# EAGLE design metronome_v1 (EAGLE 6.1)
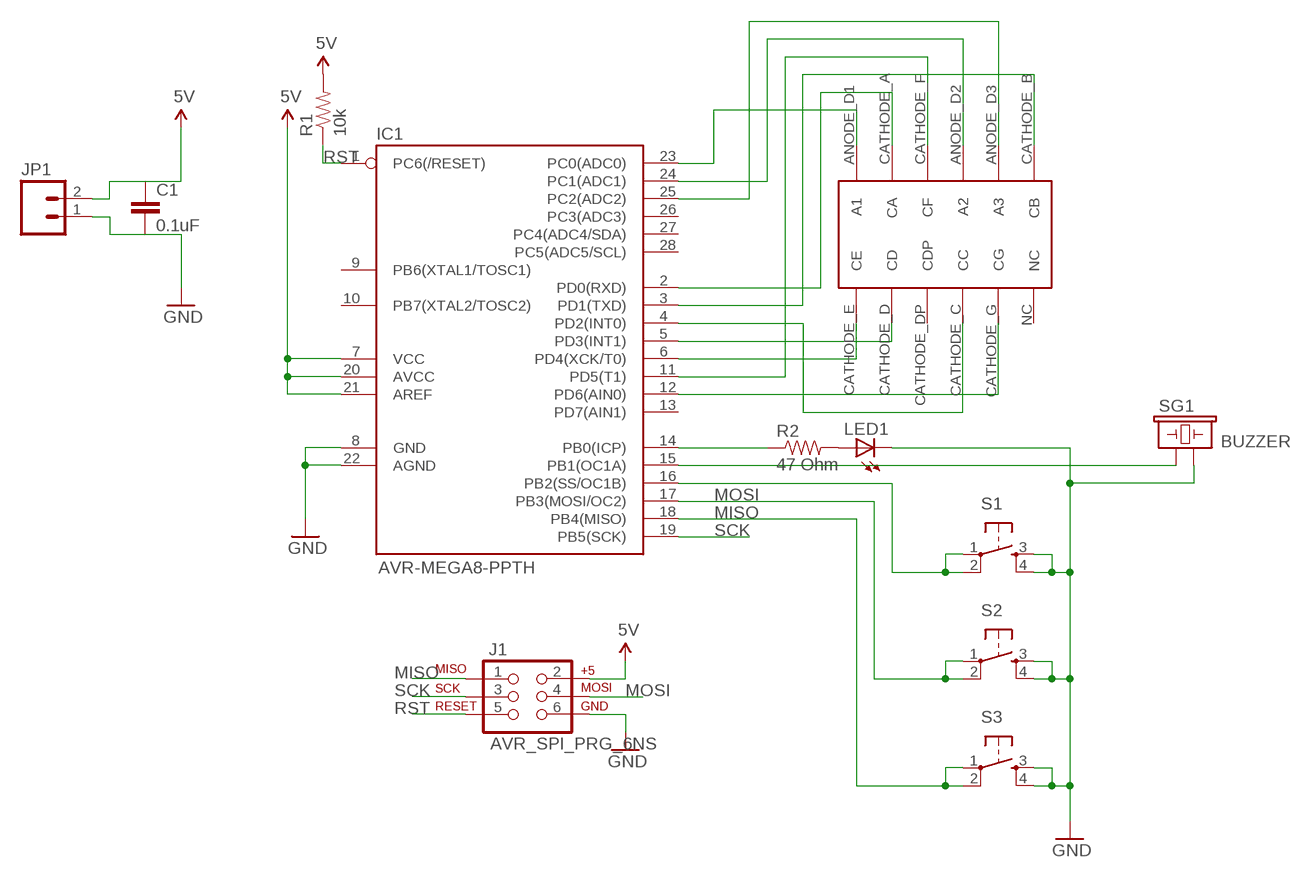
[diagram p0: schematic, sheet 1]

## Parts
C1  0.1uF  CAPPTH  [CAP-PTH-SMALL]
IC1  AVR-MEGA8-PPTH  [DIL28-3]
J1  AVR_SPI_PRG_6NS  [2X3-NS]
JP1  M02PTH3  [1X02_LONGPADS]
LED1  LED5MM  [LED5MM]
R1  10k  RESISTORAXIAL-0.3  [AXIAL-0.3]
R2  47 Ohm  RESISTORAXIAL-0.3  [AXIAL-0.3]
S1  TAC_SWITCHPTH  [TACTILE-PTH]
S2  TAC_SWITCHPTH  [TACTILE-PTH]
S3  TAC_SWITCHPTH  [TACTILE-PTH]
SG1  BUZZER  [BUZZER-762MM]
U$1  7-SEGMENT-3DIGIT-LTC516R  [7-SEGMENT-3DIGIT-LTC561R]

## Nets
5V: C1.1 IC1.7(VCC) IC1.20(AVCC) IC1.21(AREF) J1.2 JP1.2 R1.P$2
GND: C1.2 IC1.8(GND) IC1.22(AGND) J1.6 JP1.1 LED1.K(C) S1.3 S1.4 S2.3 S2.4 S3.3 S3.4 SG1.P$2
MISO: IC1.18(PB4(MISO)) J1.1 S3.1 S3.2
MOSI: IC1.17(PB3(MOSI/OC2)) J1.4 S2.1 S2.2
N$1: LED1.A R2.P$2
N$2: IC1.14(PB0(ICP)) R2.P$1
N$3: IC1.2(PD0(RXD)) U$1.CATHODE_A(CA)
N$4: IC1.3(PD1(TXD)) U$1.CATHODE_B(CB)
N$5: IC1.15(PB1(OC1A)) SG1.P$1
N$6: IC1.16(PB2(SS/OC1B)) S1.1 S1.2
N$9: IC1.4(PD2(INT0)) U$1.CATHODE_C(CC)
N$10: IC1.5(PD3(INT1)) U$1.CATHODE_D(CD)
N$11: IC1.6(PD4(XCK/T0)) U$1.CATHODE_E(CE)
N$12: IC1.11(PD5(T1)) U$1.CATHODE_F(CF)
N$13: IC1.12(PD6(AIN0)) U$1.CATHODE_G(CG)
N$14: IC1.23(PC0(ADC0)) U$1.ANODE_D1(A1)
N$15: IC1.24(PC1(ADC1)) U$1.ANODE_D2(A2)
N$16: IC1.25(PC2(ADC2)) U$1.ANODE_D3(A3)
RST: IC1.1(PC6(/RESET)) J1.5 R1.P$1
SCK: IC1.19(PB5(SCK)) J1.3
Unconnected: IC1.9(PB6(XTAL1/TOSC1)) IC1.10(PB7(XTAL2/TOSC2)) IC1.13(PD7(AIN1)) IC1.26(PC3(ADC3)) IC1.27(PC4(ADC4/SDA)) IC1.28(PC5(ADC5/SCL)) U$1.CATHODE_DP(CDP) U$1.NC

## Library data of the parts
C1 = SparkFun-Passives:CAP: Capacitor Standard 0603 ceramic capacitor, and 0.1" leaded capacitor.
IC1 = SparkFun-DigitalIC:AVR-MEGA8-P: MICROCONTROLLER 8 Kbytes FLASH 1 kbytes SRAM 512 bytes EEPROM USART 4-channel 10 bit ADC 2-channel 8 bit ADC
J1 = SparkFun-Connectors:AVR_SPI_PRG_6: AVR ISP 6 Pin This is the reduced ISP connector for AVR programming. Common on Arduino. This footprint will take up less PCB space and can be used with a 10-pin to 6-pin adapter such as SKU: BOB-08508
JP1 = SparkFun-Connectors:M02: Header 2 Standard 2-pin 0.1" header. Use with straight break away headers (SKU : PRT-00116), right angle break away headers (PRT-00553), swiss pins (PRT-00743), machine pins (PRT-00117), and female headers (PRT-00115). Molex polarized connector foot print use with SKU : PRT-08233 with associated crimp pins and housings.
LED1 = SparkFun-LED:LED: LEDs Standard schematic elements and footprints for 5mm, 3mm, 1206, and 0603 sized LEDs. 5mm - Spark Fun Electronics SKU : COM-00529 (and others)
R1 R2 = SparkFun-Passives:RESISTOR: Resistor Basic schematic elements and footprints for 0603, 1206, and PTH resistors.
S1-S3 = SparkFun-Electromechanical:TAC_SWITCH: Momentary Switch Button commonly used for reset or general input. Spark Fun Electronics SKU : COM-00097
SG1 = SparkFun-Electromechanical:BUZZER: Buzzer 12mm Spark Fun Electronics SKU : Comp-Buzzer
U$1 = SparkFun-Displays:7-SEGMENT-3DIGIT-LTC516R

## Board
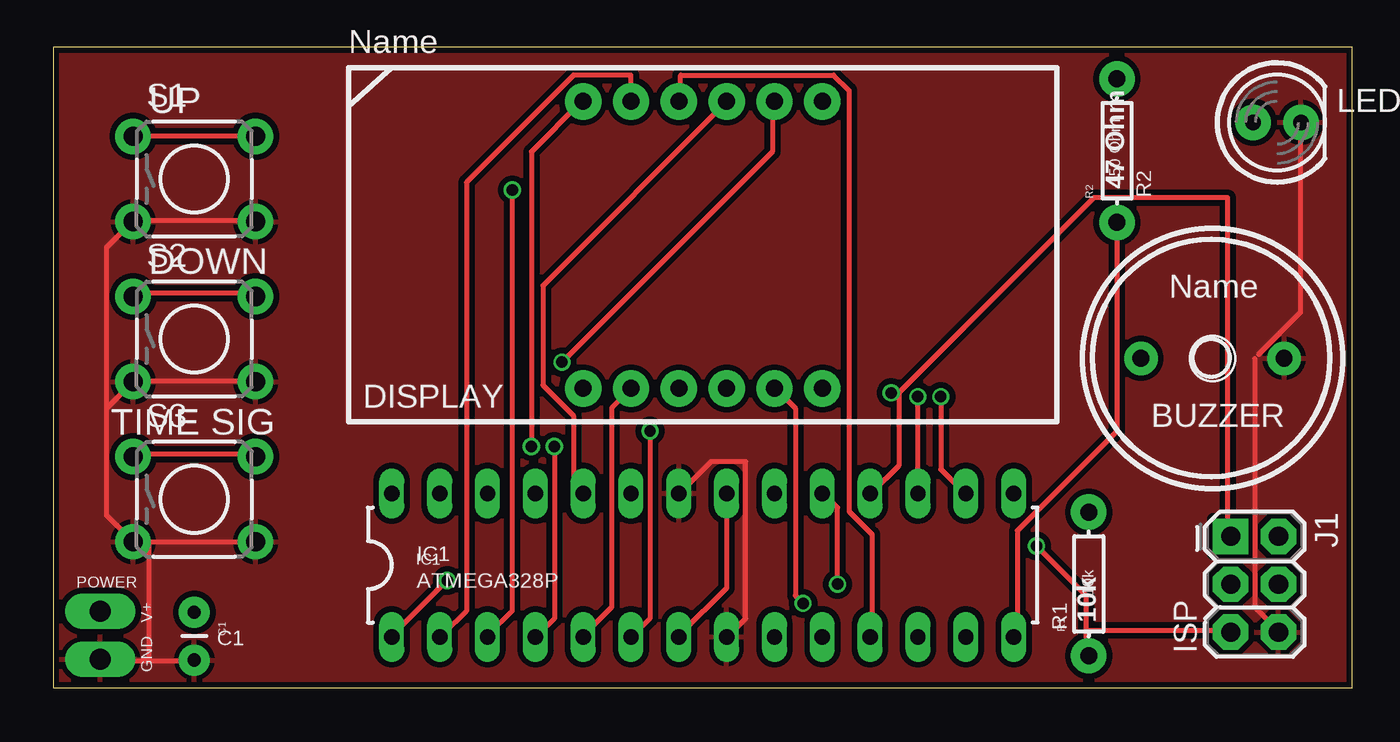
[diagram p1: board, top side]
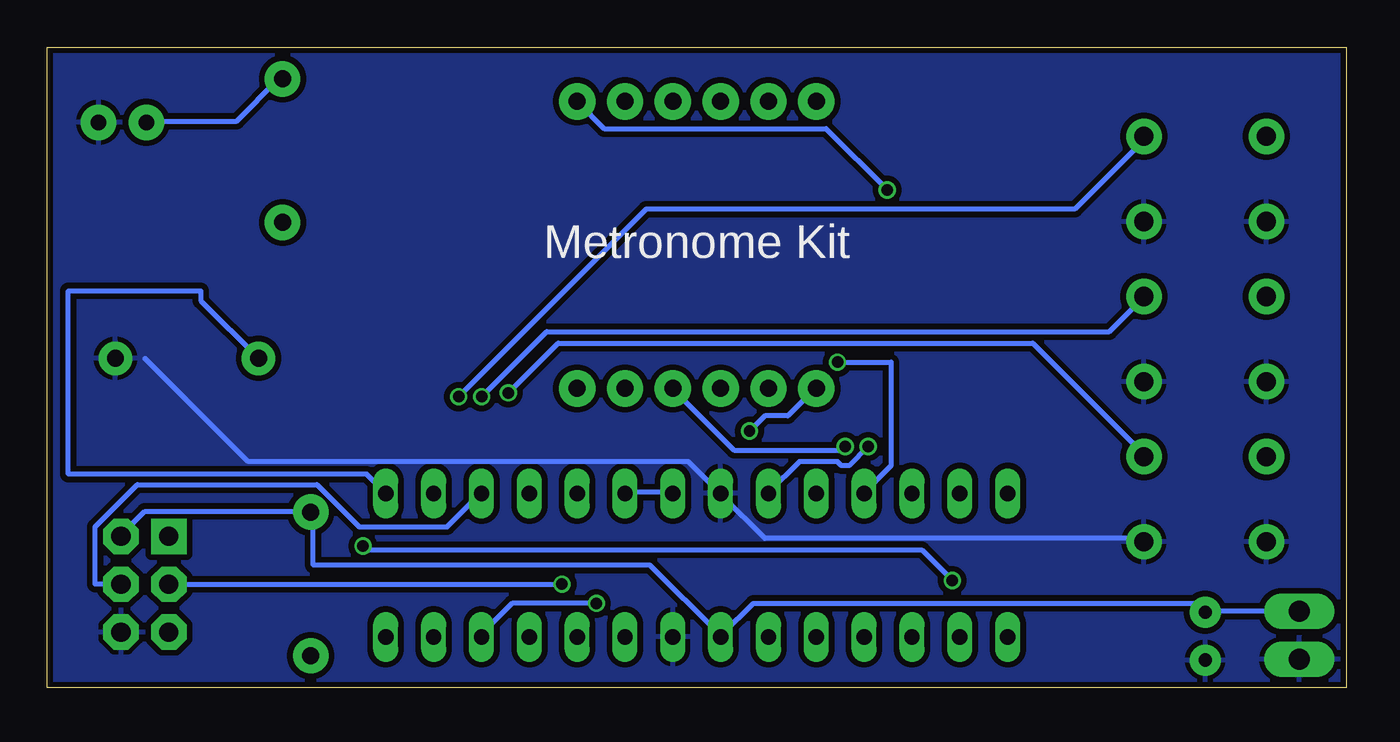
[diagram p2: board, bottom side, seen from below]

Size 69 x 34 mm. Coordinates in mm from the lower left corner, seen from the top.
Outline: 0,0 69,0 69,34 0,34 0,0
Copper layers (1*16): Top 0.035mm / dielectric 1.5mm / Bottom 0.035mm
Design rules: minimum track width 6mil, minimum drill 12mil, track to track 6mil, track to pad 6mil, pad to pad 6mil, via to via 6mil, smd to smd 0mil, copper to edge 10mil, drill to drill 10mil, minimum pad ring 10mil, minimum via ring 6mil, stop-mask expansion 2mil, vias tented up to drill 100mil, thermal gap 10mil

### Footprints (pad centres in the part's own frame; a part is rotated, then mirrored left to right if it is on the bottom)
CAP-PTH-SMALL = drill 0.7 pad 1.651: 1 0,0; 2 2.54,0
DIL28-3 = drill 0.813 long: 1 -16.51,-3.81; 2 -13.97,-3.81; 3 -11.43,-3.81; 4 -8.89,-3.81; 5 -6.35,-3.81; 6 -3.81,-3.81; 7 -1.27,-3.81; 8 1.27,-3.81; 9 3.81,-3.81; 10 6.35,-3.81; 11 8.89,-3.81; 12 11.43,-3.81; 13 13.97,-3.81; 14 16.51,-3.81; 15 16.51,3.81; 16 13.97,3.81; 17 11.43,3.81; 18 8.89,3.81; 19 6.35,3.81; 20 3.81,3.81; 21 1.27,3.81; 22 -1.27,3.81; 23 -3.81,3.81; 24 -6.35,3.81; 25 -8.89,3.81; 26 -11.43,3.81; 27 -13.97,3.81; 28 -16.51,3.81
2X3-NS = drill 1.016 pad 1.88 square: 1 -2.54,-1.27 | drill 1.016 pad 1.88 octagon: 2 -2.54,1.27; 3 0,-1.27; 4 0,1.27; 5 2.54,-1.27; 6 2.54,1.27
1X02_LONGPADS = drill 1.118 pad 1.88 long: 1 0,0; 2 2.54,0
LED5MM = drill 0.813 pad 1.88: A -1.27,0; K 1.27,0
AXIAL-0.3 = drill 0.9 pad 1.88: P$1 -3.81,0; P$2 3.81,0
TACTILE-PTH = drill 1.016 pad 1.88: 1 -3.251,2.261; 2 3.251,2.261; 3 -3.251,-2.261; 4 3.251,-2.261
BUZZER-762MM = drill 0.9 pad 1.778: P$1 -3.8,0; P$2 3.8,0
7-SEGMENT-3DIGIT-LTC561R = drill 0.9 pad 1.93: ANODE_D1 -6.35,7.62; ANODE_D2 1.27,7.62; ANODE_D3 3.81,7.62; CATHODE_A -3.81,7.62; CATHODE_B 6.35,7.62; CATHODE_C 1.27,-7.62; CATHODE_D -3.81,-7.62; CATHODE_DP -1.27,-7.62; CATHODE_E -6.35,-7.62; CATHODE_F -1.27,7.62; CATHODE_G 3.81,-7.62; NC 6.35,-7.62

### Placement (x,y rotation side)
C1  7.5,4 270 top
IC1  34.5,6.5 0 top
J1  63.8,5.49 270 top
JP1  2.5,1.5 90 top
LED1  65,30 0 top
R1  55,5.5 90 top
R2  56.5,28.5 90 top
S1  7.5,27 0 top
S2  7.5,18.5 0 top
S3  7.5,10 0 top
SG1  61.57,17.48 0 top
U$1  34.5,23.5 0 top

### Tracks (layer width: path | path; a pad name or v marks a point on that pad's centre or on a via)
5V
  Top 0.254: IC1.7 33.33,2.85 35.76,5.28 35.76,10.16 IC1.21
  Bottom 0.254: J1.2 65.02,8.13 63.8,9.35 55.07,9.35 R1.P$2 54.86,9.14 54.86,6.5 36.98,6.5 33.33,2.85 IC1.7 33.12,2.85 31.5,4.47 7.92,4.47 7.52,4.06 C1.1 7.32,4.06 2.64,4.06 JP1.2 | IC1.20 38.2,10.36 35.97,10.36 IC1.21
GND
  Top 0.254: 64.01,17.68 66.24,19.91 66.24,29.87 LED1.K | 63.8,17.48 63.8,4.27 65.02,3.05 J1.6 | IC1.22 33.33,10.36 34.95,11.99 36.78,11.99 36.78,3.66 35.97,2.85 IC1.8 | S1.4 10.57,24.79 4.27,24.79 S1.3 4.06,24.59 2.85,23.37 2.85,14.83 | S2.4 10.57,16.26 4.27,16.26 S2.3 4.06,16.05 2.85,14.83 | 5.08,1.42 2.64,1.42 JP1.1 | 5.08,1.42 7.32,1.42 C1.2 | 5.08,7.72 10.57,7.72 S3.4 | 5.08,7.72 4.27,7.72 S3.3 | 5.08,7.72 5.08,1.42 | 5.08,7.72 S3.3 | 2.85,14.83 2.85,9.14 4.06,7.92 S3.3
  Bottom 0.254: S3.4 10.77,7.92 30.89,7.92 33.12,10.16 IC1.22 33.33,10.36 34.95,11.99 58.32,11.99 63.8,17.48
  pour Top (isolate 0.305): 0,34.01 69.01,34.01 69.01,0 0,0
  pour Bottom (isolate 0.305): 0,34.01 69.01,34.01 69.01,0 0,0
MISO  (via drill 0.61)
  Top 0.254: S3.1 4.27,12.39 10.57,12.39 S3.2 | 44.91,15.65 44.91,11.79 43.48,10.36 IC1.18 | 44.91,15.65 55.27,26.01 62.38,26.01 62.38,8.13 J1.1 | 44.91,15.65 v44.5,15.65
  Bottom 0.254: v44.5,15.65 41.86,18.29 16.66,18.29 10.77,12.39 S3.2
MOSI  (via drill 0.61)
  Top 0.254: S2.1 4.27,20.93 10.57,20.93 S2.2 | v45.92,15.44 45.92,10.36 IC1.17
  Bottom 0.254: J1.4 66.45,5.49 66.45,8.53 64.21,10.77 54.66,10.77 52.43,8.53 47.75,8.53 46.13,10.16 IC1.17 | v45.92,15.44 42.47,18.9 12.6,18.9 10.77,20.73 S2.2
N$1
  Bottom 0.254: R2.P$2 56.69,32.31 58.93,30.07 63.6,30.07 LED1.A
N$2
  Top 0.254: IC1.14 51.21,2.85 51.21,8.33 56.49,13.61 56.49,24.59 R2.P$1
N$3
  Top 0.254: IC1.2 20.73,2.85 21.95,4.06 21.95,26.82 27.64,32.51 30.68,32.51 30.68,31.29 U$1.CATHODE_A
N$4  (via drill 0.61)
  Top 0.254: v24.38,26.42 24.38,4.06 23.16,2.85 IC1.3
  Bottom 0.254: v24.38,26.42 27.64,29.67 39.42,29.67 40.84,31.09 U$1.CATHODE_B
N$5
  Bottom 0.254: IC1.15 52.03,11.33 67.87,11.33 67.87,21.06 60.83,21.06 60.83,20.54 SG1.P$1
N$6  (via drill 0.61)
  Top 0.254: v47.14,15.44 47.14,11.58 48.36,10.36 IC1.16 | S1.1 4.27,29.26 10.57,29.26 S1.2
  Bottom 0.254: v47.14,15.44 37.19,25.4 14.43,25.4 10.77,29.06 S1.2
N$9  (via drill 0.61)
  Top 0.254: v26.62,12.8 26.62,3.66 25.81,2.85 IC1.4
  Bottom 0.254: v26.62,12.8 26.82,12.6 32.51,12.6 35.76,15.85 U$1.CATHODE_C
N$10
  Top 0.254: IC1.5 28.25,2.85 29.67,4.27 29.67,14.83 30.68,15.85 U$1.CATHODE_D
N$11  (via drill 0.61)
  Top 0.254: v31.7,13.61 31.7,3.66 30.89,2.85 IC1.6
  Bottom 0.254: v31.7,13.61 30.89,14.43 29.67,14.43 28.25,15.85 U$1.CATHODE_E
N$12
  Top 0.254: IC1.11 43.48,2.85 43.48,8.13 42.27,9.35 42.27,31.7 41.45,32.51 33.33,32.51 33.33,31.29 U$1.CATHODE_F
N$13  (via drill 0.61)
  Top 0.254: v39.83,4.47 39.42,4.88 39.42,14.83 38.41,15.85 U$1.CATHODE_G
  Bottom 0.254: v39.83,4.47 44.3,4.47 45.92,2.85 IC1.12
N$14  (via drill 0.61)
  Top 0.254: v25.4,12.8 25.4,28.45 28.04,31.09 U$1.ANODE_D1
  Bottom 0.254: v25.4,12.8 26.42,11.79 26.82,11.79 27.03,11.99 29.06,11.99 30.68,10.36 IC1.23
N$15
  Top 0.254: IC1.24 28.04,10.36 27.64,10.77 27.64,14.43 26.01,16.05 26.01,21.34 35.76,31.09 U$1.ANODE_D2
N$16  (via drill 0.61)
  Top 0.254: v27.03,17.27 38.2,28.45 38.2,31.09 U$1.ANODE_D3
  Bottom 0.254: v27.03,17.27 24.18,17.27 24.18,11.79 25.6,10.36 IC1.25
RST  (via drill 0.61)
  Top 0.254: v20.93,5.69 18.09,2.85 IC1.1 | v52.22,7.52 54.86,4.88 54.86,3.05 | 54.86,3.05 54.86,1.83 R1.P$1 | 54.86,3.05 62.38,3.05 J1.5
  Bottom 0.254: v20.93,5.69 22.55,7.32 52.02,7.32 v52.22,7.52
SCK  (via drill 0.61)
  Top 0.254: v41.66,5.49 41.66,9.55 41.05,10.16 IC1.19
  Bottom 0.254: J1.3 v41.66,5.49

### Text on the board
_tsilk: UP | 150 Ohm | R2 | DOWN | DISPLAY | BUZZER | TIME SIG | IC1 | POWER | ATMEGA328P | 10k | V+ | C1 | R1 | ISP | GND
_bsilk: Metronome Kit